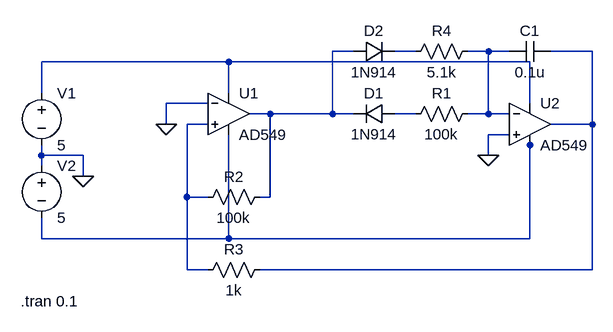
[diagram p0: schematic sawtooth3.asc]
sawtooth3.asc, the LTspice schematic file:
Version 4
SHEET 1 880 680
WIRE 320 16 288 16
WIRE 416 16 384 16
WIRE 528 16 496 16
WIRE 560 16 528 16
WIRE 688 16 624 16
WIRE 128 32 -160 32
WIRE 592 32 128 32
WIRE -160 80 -160 32
WIRE 128 80 128 32
WIRE 96 96 32 96
WIRE 592 96 592 32
WIRE 192 112 160 112
WIRE 288 112 288 16
WIRE 288 112 192 112
WIRE 320 112 288 112
WIRE 416 112 384 112
WIRE 528 112 528 16
WIRE 528 112 496 112
WIRE 560 112 528 112
WIRE 32 128 32 96
WIRE 96 128 64 128
WIRE 688 128 688 16
WIRE 688 128 624 128
WIRE 560 144 528 144
WIRE 592 160 592 144
WIRE -160 176 -160 160
WIRE -96 176 -160 176
WIRE 528 176 528 144
WIRE -160 192 -160 176
WIRE -96 208 -96 176
WIRE 64 240 64 128
WIRE 96 240 64 240
WIRE 192 240 192 112
WIRE 192 240 176 240
WIRE -160 304 -160 272
WIRE 128 304 128 144
WIRE 128 304 -160 304
WIRE 592 304 592 160
WIRE 592 304 128 304
WIRE 64 352 64 240
WIRE 96 352 64 352
WIRE 688 352 688 128
WIRE 688 352 176 352
FLAG 32 128 0
FLAG 528 176 0
FLAG -96 208 0
SYMBOL Opamps\\AD549 128 48 R0
SYMATTR InstName U1
SYMBOL Opamps\\AD549 592 64 R0
SYMATTR InstName U2
SYMBOL res 512 96 R90
WINDOW 0 0 56 VBottom 2
WINDOW 3 32 56 VTop 2
SYMATTR InstName R1
SYMATTR Value 100k
SYMBOL res 192 224 R90
WINDOW 0 0 56 VBottom 2
WINDOW 3 32 56 VTop 2
SYMATTR InstName R2
SYMATTR Value 100k
SYMBOL res 192 336 R90
WINDOW 0 0 56 VBottom 2
WINDOW 3 32 56 VTop 2
SYMATTR InstName R3
SYMATTR Value 1k
SYMBOL cap 624 0 R90
WINDOW 0 0 32 VBottom 2
WINDOW 3 32 32 VTop 2
SYMATTR InstName C1
SYMATTR Value 0.1u
SYMBOL voltage -160 64 R0
WINDOW 123 0 0 Left 0
WINDOW 39 0 0 Left 0
SYMATTR InstName V1
SYMATTR Value 5
SYMBOL voltage -160 176 R0
WINDOW 123 0 0 Left 0
WINDOW 39 0 0 Left 0
SYMATTR InstName V2
SYMATTR Value 5
SYMBOL res 512 0 R90
WINDOW 0 0 56 VBottom 2
WINDOW 3 32 56 VTop 2
SYMATTR InstName R4
SYMATTR Value 5.1k
SYMBOL diode 384 96 R90
WINDOW 0 0 32 VBottom 2
WINDOW 3 32 32 VTop 2
SYMATTR InstName D1
SYMATTR Value 1N914
SYMBOL diode 320 32 R270
WINDOW 0 32 32 VTop 2
WINDOW 3 0 32 VBottom 2
SYMATTR InstName D2
SYMATTR Value 1N914
TEXT -192 400 Left 2 !.tran 0.1

The netlist it stands for:
* sawtooth3.asc
XU1 N007 0 N005 N008 N001 AD549  ; pins In+ In- V+ V- OUT
XU2 0 N003 N005 N008 N004 AD549  ; pins In+ In- V+ V- OUT
R1 N003 N006 100k
R2 N001 N007 100k
R3 N004 N007 1k
C1 N004 N003 0.1u
V1 N005 0 5
V2 0 N008 5
R4 N003 N002 5.1k
D1 N006 N001 1N914
D2 N001 N002 1N914
.model D D
.lib standard.dio
.tran 0.1
.backanno
.end